# EAGLE schematic WarningFlasher (EAGLE 5.11)
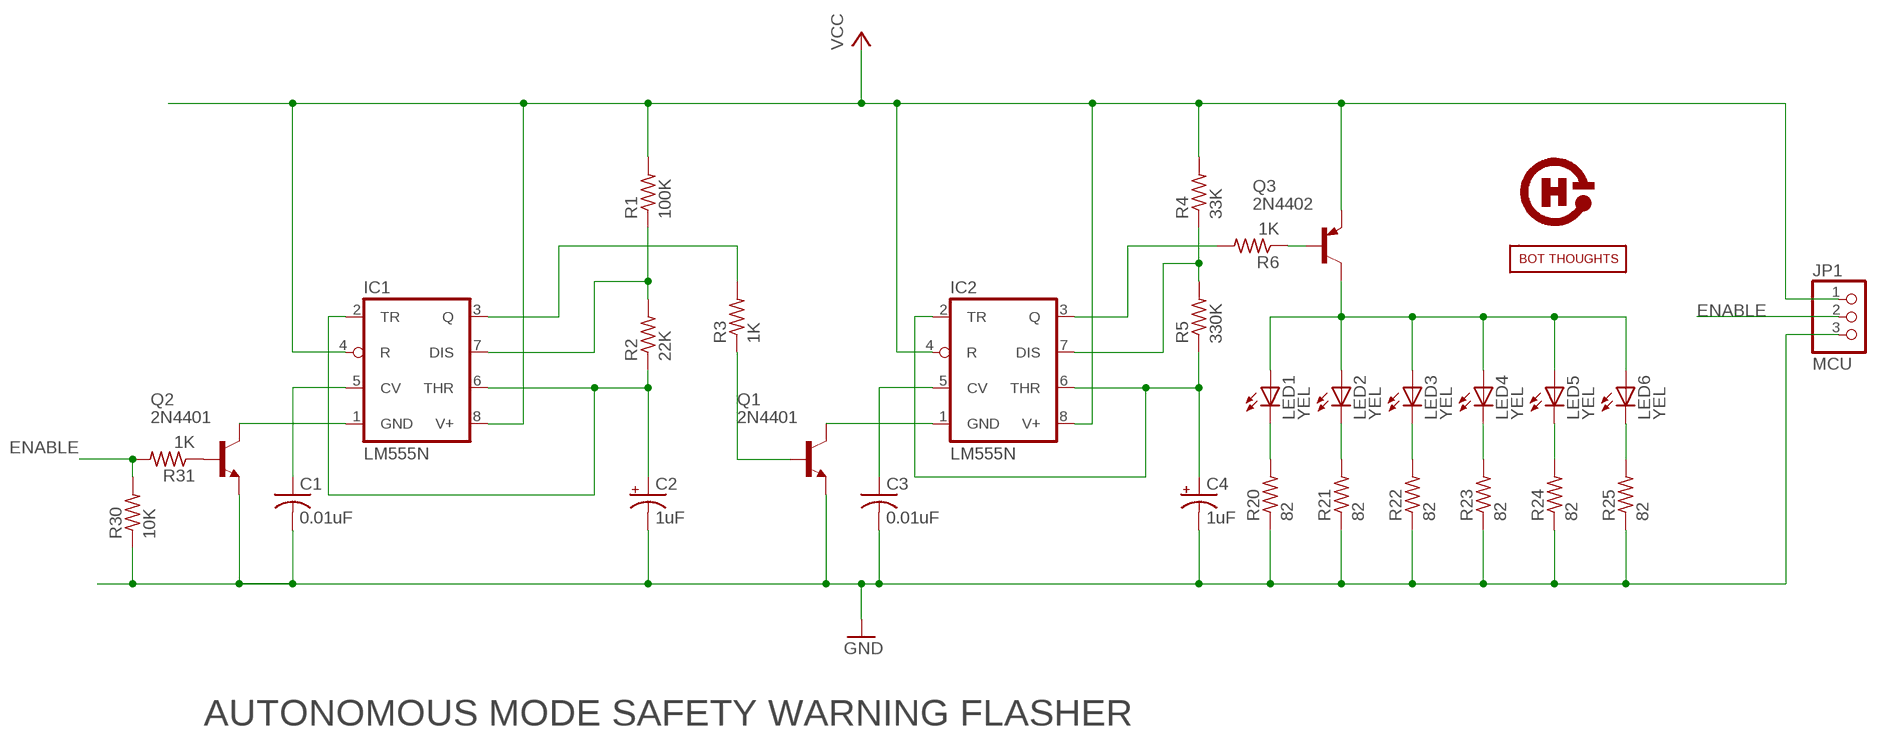
[diagram p0: schematic, sheet 1]

## Parts
C1  0.01uF  C-US025-024X044  [C025-024X044]
C2  1uF  CPOL-USE2,5-6E  [E2,5-6E]
C3  0.01uF  C-US050-024X044  [C050-024X044]
C4  1uF  CPOL-USE2,5-6E  [E2,5-6E]
IC1  LM555N  [DIL08]
IC2  LM555N  [DIL08]
JP1  MCU  PINHD-1X03_2.54-S  [1X03-S]
LED1  YEL  LED5MM  [LED5MM]
LED2  YEL  LED5MM  [LED5MM]
LED3  YEL  LED5MM  [LED5MM]
LED4  YEL  LED5MM  [LED5MM]
LED5  YEL  LED5MM  [LED5MM]
LED6  YEL  LED5MM  [LED5MM]
Q1  2N4401  2N3904INLINE  [TO92-CBE]
Q2  2N4401  2N3904INLINE  [TO92-CBE]
Q3  2N4402  2N3906INLINE  [TO92-CBE]
R1  100K  R-US_0204/5  [0204/5]
R2  22K  R-US_0204/5  [0204/5]
R3  1K  R-US_0204/5  [0204/5]
R4  33K  R-US_0204/5  [0204/5]
R5  330K  R-US_0204/5  [0204/5]
R6  1K  R-US_0204/5  [0204/5]
R20  82  R-US_0204/5  [0204/5]
R21  82  R-US_0204/5  [0204/5]
R22  82  R-US_0204/5  [0204/5]
R23  82  R-US_0204/5  [0204/5]
R24  82  R-US_0204/5  [0204/5]
R25  82  R-US_0204/5  [0204/5]
R30  10K  R-US_0204/5  [0204/5]
R31  1K  R-US_0204/5  [0204/5]
U$1  OSHW-LOGO  [OSHW-LOGO]
U$2  BOT-THOUGHTS  [BOT-THOUGHTS]

## Nets
ENABLE: JP1.2 R30.2 R31.2
GND: C1.2 C2.- C3.2 C4.- JP1.3 Q1.E Q2.E R20.1 R21.1 R22.1 R23.1 R24.1 R25.1 R30.1
N$1: LED1.A LED2.A LED3.A LED4.A LED5.A LED6.A Q3.C
N$2: C3.1 IC2.5(CV)
N$3: IC1.3(Q) R3.2
N$4: IC2.1(GND) Q1.C
N$5: Q1.B R3.1
N$6: LED1.K(C) R20.2
N$7: IC1.1(GND) Q2.C
N$8: IC2.3(Q) R6.2
N$9: C1.1 IC1.5(CV)
N$10: LED5.K(C) R24.2
N$11: C2.+ IC1.2(TR) IC1.6(THR) R2.1
N$12: LED2.K(C) R21.2
N$13: IC1.7(DIS) R1.1 R2.2
N$14: LED6.K(C) R25.2
N$15: IC2.7(DIS) R4.1 R5.2
N$16: Q3.B R6.1
N$17: C4.+ IC2.2(TR) IC2.6(THR) R5.1
N$18: Q2.B R31.1
N$19: LED3.K(C) R22.2
N$22: LED4.K(C) R23.2
VCC: IC1.4(R) IC1.8(V+) IC2.4(R) IC2.8(V+) JP1.1 Q3.E R1.2 R4.2

## Notes on the sheet
- AUTONOMOUS MODE SAFETY WARNING FLASHER

## Library data of the parts
C1 C3 = rcl:C-US: CAPACITOR, American symbol
C2 C4 = rcl:CPOL-US: POLARIZED CAPACITOR, American symbol
IC1 IC2 = linear:*555: TIMER
JP1 = pinhead-2:PINHD-1X03: PIN HEADER
LED1-LED6 = led:LED: LED OSRAM: - CHIPLED LG R971, LG N971, LY N971, LG Q971, LY Q971, LO R971, LY R971 LH N974, LH R974 LS Q976, LO Q976, LY Q976 LO Q996 - Hyper CHIPLED LW Q18S LB Q993, LB Q99A, LB R99A - SideLED LS A670, LO A670, LY A670, LG A670, LP A670 LB A673, LV A673, LT A673, LW A673 LH A674 LY A675 LS A676, LA A676, LO A676, LY A676, LW A676 LS A679, LY A679, LG A679 - Hyper Micro SIDELED® LS Y876, LA Y876, LO Y876, LY Y876 LT Y87S - SmartLED LW L88C, LW L88S LB L89C, LB L89S, LG L890 LS L89K, LO L89K, LY L89K LS L896, LA L896, LO L896, LY L896 - TOPLED LS T670, LO T670, LY T670, LG T670, LP T670 LSG T670, LSP T670, LSY T670, LOP T670, LYG T670 LG T671, LOG T671, LSG T671 LB T673, LV T673, LT T673, LW T673 LH T674 LS T676, LA T676, LO T676, LY T676, LB T676, LH T676, LSB T676, LW T676 LB T67C, LV T67C, LT T67C, LS T67K, LO T67K, LY T67K, LW E67C LS E67B, LA E67B, LO E67B, LY E67B, LB E67C, LV E67C, LT E67C LW T67C LS T679, LY T679, LG T679 LS T770, LO T770, LY T770, LG T770, LP T770 LB T773, LV T773, LT T773, LW T773 LH T774 LS E675, LA E675, LY E675, LS T675 LS T776, LA T776, LO T776, LY T776, LB T776 LHGB T686 LT T68C, LB T68C - Hyper Mini TOPLED® LB M676 - Mini TOPLED Santana® LG M470 LS M47K, LO M47K, LY M47K Source: http://www.osram.convergy.de LUXEON: - LUMILED® LXK2-PW12-R00, LXK2-PW12-S00, LXK2-PW14-U00, LXK2-PW14-V00 LXK2-PM12-R00, LXK2-PM12-S00, LXK2-PM14-U00 LXK2-PE12-Q00, LXK2-PE12-R00, LXK2-PE12-S00, LXK2-PE14-T00, LXK2-PE14-U00 LXK2-PB12-K00, LXK2-PB12-L00, LXK2-PB12-M00, LXK2-PB14-N00, LXK2-PB14-P00, LXK2-PB14-Q00 LXK2-PR12-L00, LXK2-PR12-M00, LXK2-PR14-Q00, LXK2-PR14-R00 LXK2-PD12-Q00, LXK2-PD12-R00, LXK2-PD12-S00 LXK2-PH12-R00, LXK2-PH12-S00 LXK2-PL12-P00, LXK2-PL12-Q00, LXK2-PL12-R00 Source: www.luxeon.com KINGBRIGHT: KA-3528ASYC Source: www.kingbright.com
Q1 Q2 = mes:2N3904: NPN Transistor Small signal NPN Bipolar Junction Transistor (BJT). Use this device to represent any of a number of such transistors with similar package and pinout: 2N4401, 2N3904, 2N2222, etc.
Q3 = mes:2N3906: PNP Transistor Small signal PNP Bipolar Junction Transistor (BJT). Use this device to represent any of a number of such transistors with similar package and pinout: 2N4402, 2N3906, etc.
R1-R6 R20-R25 R30 R31 = rcl:R-US_: RESISTOR, American symbol
U$1 = SparkFun:OSHW-LOGO: Open Source Hardware Logo This logo indicates the piece of hardware it is found on incorporates a OSHW license and/or adheres to the definition of open source hardware found here: http://freedomdefined.org/OSHW
U$2 = mes:BOT-THOUGHTS